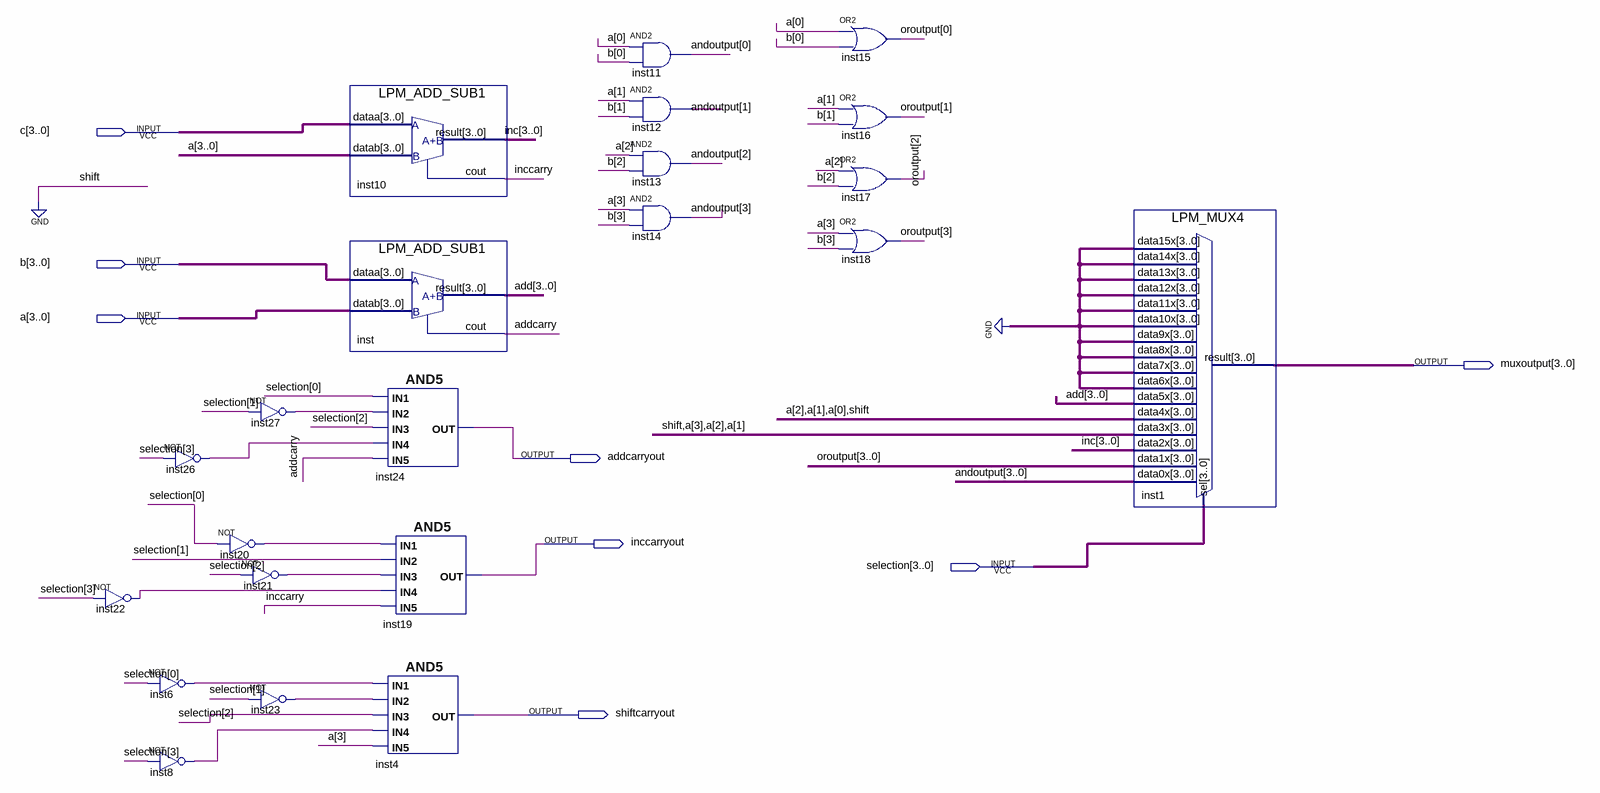
[diagram p0: schematic sheet]
// Quartus schematic Nilay_Yucel_2017510082_Lab4.bdf as structural Verilog: 22 symbols, 8 pins
module Nilay_Yucel_2017510082_Lab4 (
  input  [3:0] c,
  input  [3:0] b,
  input  [3:0] a,
  input  [3:0] selection,
  output [3:0] muxoutput,
  output addcarryout,
  output inccarryout,
  output shiftcarryout
);

  wire addcarry, inccarry, inst6_out, inst8_out, inst20_out, inst21_out, inst22_out, inst23_out, inst26_out,
       inst27_out;
  wire [3:0] add, andoutput, inc, oroutput;

  not inst22 (inst22_out, selection[3]);
  not inst26 (inst26_out, selection[3]);
  not inst6 (inst6_out, selection[0]);
  not inst8 (inst8_out, selection[3]);
  not inst20 (inst20_out, selection[0]);
  not inst21 (inst21_out, selection[2]);
  not inst27 (inst27_out, selection[1]);
  not inst23 (inst23_out, selection[1]);
  LPM_ADD_SUB1 inst10 (.dataa(c), .datab(a), .result(inc), .cout(inccarry));
  LPM_ADD_SUB1 inst (.dataa(b), .datab(a), .result(add), .cout(addcarry));
  and inst24 (addcarryout, selection[0], inst27_out, selection[2], inst26_out, addcarry);
  and inst19 (inccarryout, inst20_out, selection[1], inst21_out, inst22_out, inccarry);
  and inst4 (shiftcarryout, inst6_out, inst23_out, selection[2], inst8_out, a[3]);
  and inst11 (andoutput[0], a[0], b[0]);
  and inst12 (andoutput[1], a[1], b[1]);
  and inst13 (andoutput[2], a[2], b[2]);
  and inst14 (andoutput[3], a[3], b[3]);
  or inst15 (oroutput[0], a[0], b[0]);
  or inst16 (oroutput[1], a[1], b[1]);
  or inst17 (oroutput[2], a[2], b[2]);
  or inst18 (oroutput[3], a[3], b[3]);
  LPM_MUX4 inst1 (
    .data15x(4'b0000), .data14x(4'b0000), .data13x(4'b0000), .data12x(4'b0000), .data11x(4'b0000),
    .data10x(4'b0000), .data9x(4'b0000), .data8x(4'b0000), .data7x(4'b0000), .data6x(4'b0000), .data5x(add),
    .data4x({a[2:0], 1'b0}), .data3x({1'b0, a[3:1]}), .data2x(inc), .data1x(oroutput), .data0x(andoutput),
    .sel(selection), .result(muxoutput));
endmodule
